# Altium project HAGateWay202205V10.PrjPcb (part 2 of 2)

## Sheet 11. MT7688AN Ethernet.SchDoc
size A4; DocumentNumber: 11; SheetNumber: 11; SheetTotal: 12
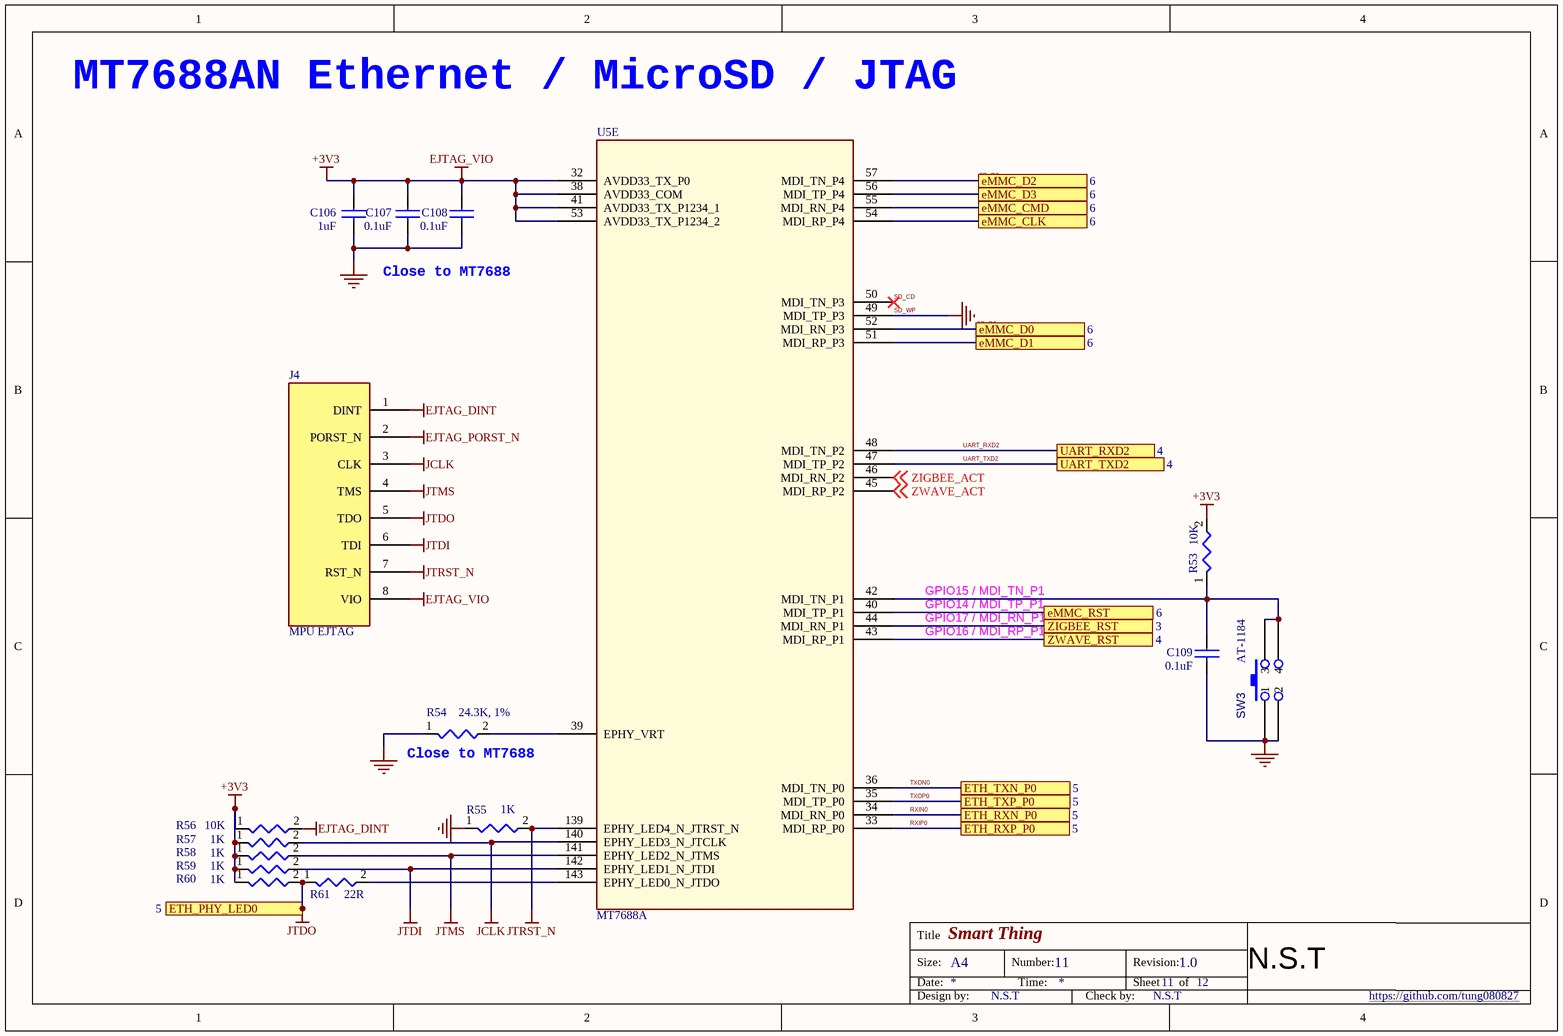
[diagram p11: 11. MT7688AN Ethernet.SchDoc]

### Parts
C106  1uF  [CAPC1005X60X30NL05T10]
C107  0.1uF  [CAPC1005X60X30NL05T10]
C108  0.1uF  [CAPC1005X60X30NL05T10]
C109  0.1uF  [CAPC1005X60X30NL05T10]
J4  MPU EJTAG  [MPU EJTAG DEBUG]
R53  10K  [RESC1005X35X25NL10T10]
R54  24.3K, 1%  [RESC1005X35X25NL10T10]
R55  1K  [RESC1005X35X25NL10T10]
R56  10K  [RESC1005X35X25NL10T10]
R57  1K  [RESC1005X35X25NL10T10]
R58  1K  [RESC1005X35X25NL10T10]
R59  1K  [RESC1005X35X25NL10T10]
R60  1K  [RESC1005X35X25NL10T10]
R61  22R  [RESC1005X35X25NL10T10]
SW3  AT-1184  [AT-1184 SW]
U5  MT7688A  [MT7628AN$2F$DRQFN156$2F$SMD$2F$P0.5$2F$12X12]  (part E of 6)

### Ports
eMMC_CLK (see 6), eMMC_CMD (see 6), eMMC_D0 (see 6), eMMC_D1 (see 6), eMMC_D2 (see 6), eMMC_D3 (see 6), eMMC_RST (see 6), ETH_PHY_LED0 (see 5), ETH_RXN_P0 (see 5), ETH_RXP_P0 (see 5), ETH_TXN_P0 (see 5), ETH_TXP_P0 (see 5), UART_RXD2 (see 4), UART_TXD2 (see 4), ZIGBEE_RST (see 3), ZWAVE_RST (see 4)

### Nets
+3V3: C106.1 C107.1 C108.1 J4.8(VIO) R53.2 R56.1 R57.1 R58.1 R59.1 R60.1 U5.32(AVDD33_TX_P0) U5.38(AVDD33_COM) U5.41(AVDD33_TX_P1234_1) U5.53(AVDD33_TX_P1234_2)  [also labelled EJTAG_VIO]
EJTAG_DINT: J4.1(DINT) R56.2
EJTAG_PORST_N: J4.2(PORST_N)
GND: C106.2 C107.2 C108.2 C109.2 R54.1 R55.1 SW3.1 SW3.2 U5.49(MDI_TP_P3)  [also labelled SD_WP]
JCLK: J4.3(CLK) R57.2 U5.140(EPHY_LED3_N_JTCLK)
JTDI: J4.6(TDI) R59.2 U5.142(EPHY_LED1_N_JTDI)
JTDO: J4.5(TDO) R60.2 R61.1 ; port ETH_PHY_LED0
JTMS: J4.4(TMS) R58.2 U5.141(EPHY_LED2_N_JTMS)
JTRST_N: J4.7(RST_N) R55.2 U5.139(EPHY_LED4_N_JTRST_N)
GPIO14 / MDI_TP_P1: U5.40(MDI_TP_P1) ; port eMMC_RST
GPIO15 / MDI_TN_P1: C109.1 R53.1 SW3.3 SW3.4 U5.42(MDI_TN_P1)
GPIO16 / MDI_RP_P1: U5.43(MDI_RP_P1) ; port ZWAVE_RST
GPIO17 / MDI_RN_P1: U5.44(MDI_RN_P1) ; port ZIGBEE_RST
RXIN0: U5.34(MDI_RN_P0) ; port ETH_RXN_P0  [project net ETH_RX_N]
RXIP0: U5.33(MDI_RP_P0) ; port ETH_RXP_P0  [project net ETH_RX_P]
SD_CD: U5.50(MDI_TN_P3)
SD_CLK: U5.54(MDI_RP_P4) ; port eMMC_CLK  [project net eMMC_CLKL]
SD_CMD: U5.55(MDI_RN_P4) ; port eMMC_CMD
SD_D0: U5.52(MDI_RN_P3) ; port eMMC_D0
SD_D1: U5.51(MDI_RP_P3) ; port eMMC_D1
SD_D2: U5.57(MDI_TN_P4) ; port eMMC_D2
SD_D3: U5.56(MDI_TP_P4) ; port eMMC_D3
TXON0: U5.36(MDI_TN_P0) ; port ETH_TXN_P0  [project net ETH_TX_N]
TXOP0: U5.35(MDI_TP_P0) ; port ETH_TXP_P0  [project net ETH_TX_P]
UART_RXD2: U5.48(MDI_TN_P2) ; port UART_RXD2
UART_TXD2: U5.47(MDI_TP_P2) ; port UART_TXD2
ZIGBEE_ACT: U5.46(MDI_RN_P2) ; off-sheet ZIGBEE_ACT
ZWAVE_ACT: U5.45(MDI_RP_P2) ; off-sheet ZWAVE_ACT
NetR54_2: R54.2 U5.39(EPHY_VRT)
NetR61_2: R61.2 U5.143(EPHY_LED0_N_JTDO)

### Notes on the sheet
- MT7688AN Ethernet / MicroSD / JTAG
- Close to MT7688
- (near R54) Close to MT7688
- Title
- Size:
- Date:
- A4
- Number:
- Time:
- Revision:
- Sheet
- of
- N.S.T
- Design by:
- Check by:
- https://github.com/tung080827

### Library data of the parts
C106-C109 = CAP NP
R53-R61 = RES/0402_3
SW3 = SW: TACT Switch, H=1.5mm; Manufacturer: Panasonic - ECG; Manufacturer P/N: EVQ-Q2B01W; Distributor P/N: P12930SCT-ND; Distributor: Digikey
U5 = MT7620N-n_26

## Sheet 12. MT7688AN Power.SchDoc
size A4; DocumentNumber: 12; SheetNumber: 12; SheetTotal: 12
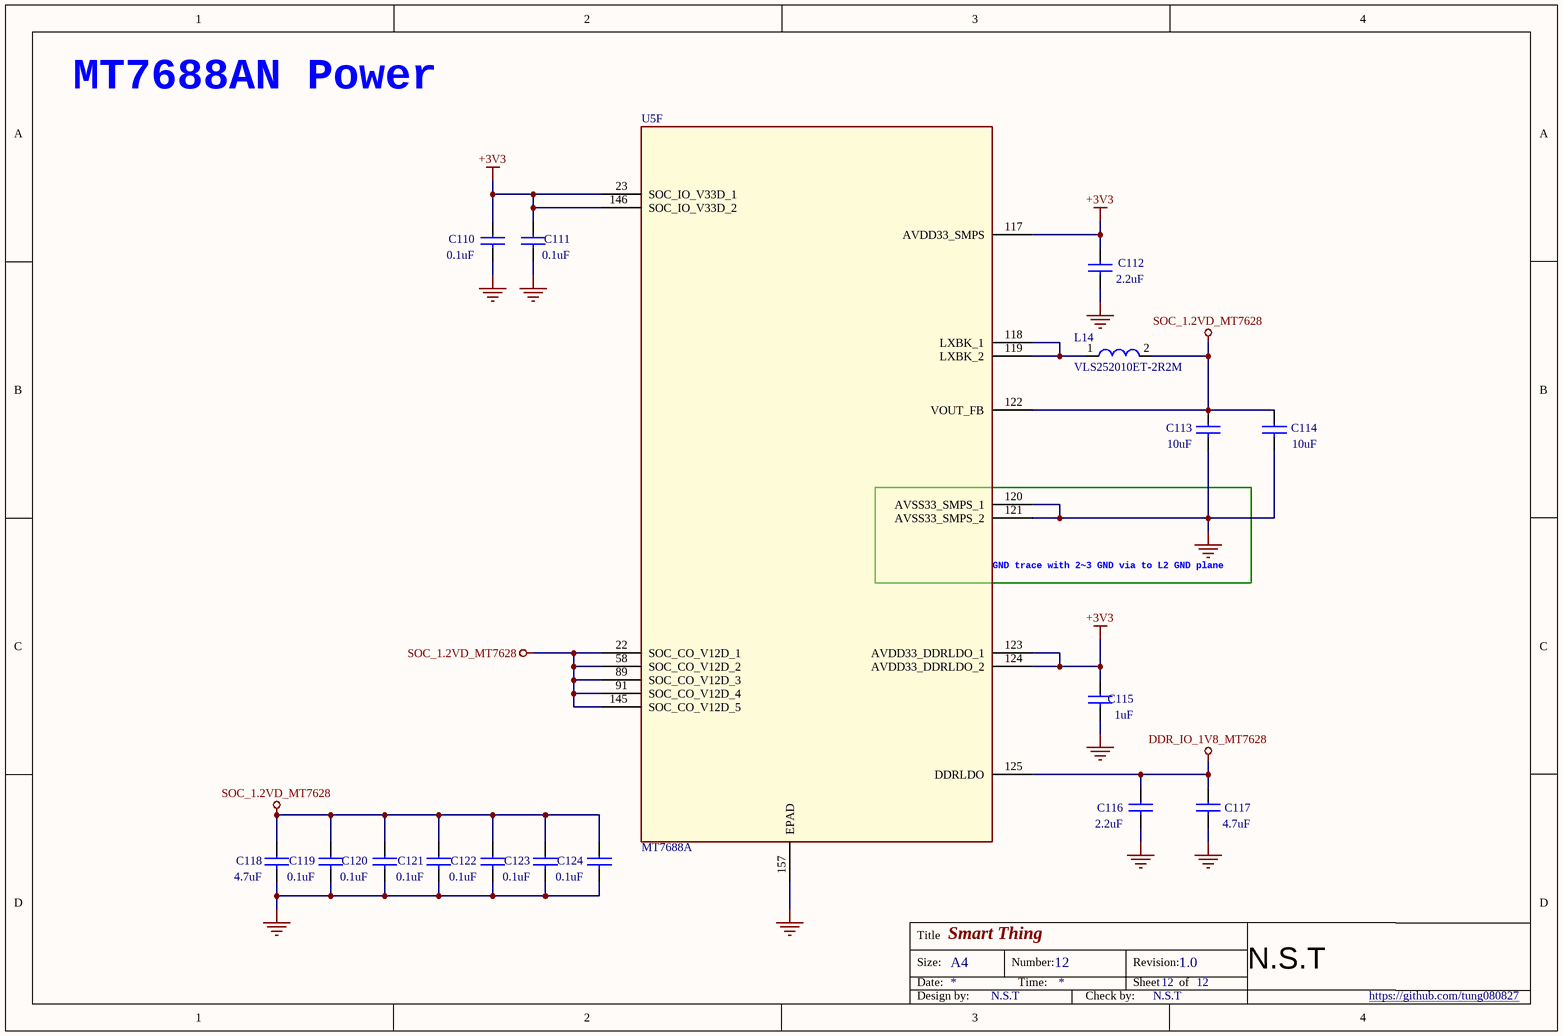
[diagram p12: 12. MT7688AN Power.SchDoc]

### Parts
C110  0.1uF  [CAPC1005X55X25NL05T10]
C111  0.1uF  [CAPC1005X55X25NL05T10]
C112  2.2uF  [CAPC1608X90X35NL10T15]
C113  10uF  [CAPC1608X90X35NL10T15]
C114  10uF  [CAPC1608X90X35NL10T15]
C115  1uF  [CAPC1608X90X35NL10T15]
C116  2.2uF  [CAPC1608X90X35NL10T15]
C117  4.7uF  [CAPC1005X55X25NL05T10]
C118  4.7uF  [CAPC1005X55X25NL05T10]
C119  0.1uF  [CAPC1005X55X25NL05T10]
C120  0.1uF  [CAPC1005X55X25NL05T10]
C121  0.1uF  [CAPC1005X55X25NL05T10]
C122  0.1uF  [CAPC1005X55X25NL05T10]
C123  0.1uF  [CAPC1005X55X25NL05T10]
C124  0.1uF  [CAPC1005X55X25NL05T10]
L14  VLS252010ET-2R2M  [VLS252010/TDK INDUCTOR]
U5  MT7688A  [MT7628AN$2F$DRQFN156$2F$SMD$2F$P0.5$2F$12X12]  (part F of 6)

### Nets
+3V3: C110.1 C111.1 C112.1 C115.1 U5.23(SOC_IO_V33D_1) U5.117(AVDD33_SMPS) U5.123(AVDD33_DDRLDO_1) U5.124(AVDD33_DDRLDO_2) U5.146(SOC_IO_V33D_2)
DDR_IO_1V8_MT7628: C116.1 C117.1 U5.125(DDRLDO)
GND: C110.2 C111.2 C112.2 C113.2 C114.2 C115.2 C116.2 C117.2 C118.2 C119.2 C120.2 C121.2 C122.2 C123.2 C124.2 U5.120(AVSS33_SMPS_1) U5.121(AVSS33_SMPS_2) U5.157(EPAD)
SOC_1.2VD_MT7628: C113.1 C114.1 C118.1 C119.1 C120.1 C121.1 C122.1 C123.1 C124.1 L14.2 U5.22(SOC_CO_V12D_1) U5.58(SOC_CO_V12D_2) U5.89(SOC_CO_V12D_3) U5.91(SOC_CO_V12D_4) U5.122(VOUT_FB) U5.145(SOC_CO_V12D_5)
NetL14_1: L14.1 U5.118(LXBK_1) U5.119(LXBK_2)

### Notes on the sheet
- MT7688AN Power
- (near U5) GND trace with 2~3 GND via to L2 GND plane
- Title
- Size:
- Date:
- A4
- Number:
- Time:
- Revision:
- Sheet
- of
- N.S.T
- Design by:
- Check by:
- https://github.com/tung080827

### Library data of the parts
C110-C124 = CAP NP
L14 = L/0402: IND 0805 METAL 2.2uH 0.19R 1.2A T=1.0mm
U5 = MT7620N-n_26

## Nets that join several sheets
+3V3: 02. POWER (5 pins), 03. ZIGBEE (FB1.1 FB2.1 TP1.1), 04. Z-WAVE (FB3.2 R9.2), 06. ETHERNET (J1.9 J1.12 R12.2), 05. eMMC (22 pins), 07. MT7688AN RF Front End (C44.1 C45.1 C46.1 R20.1), 09. MT7688AN Peripheral (12 pins), 10. MT7688AN USB-PCIe (5 pins), 11. MT7688AN Ethernet (14 pins), 12. MT7688AN Power (9 pins)
+5V_USB: 02. POWER (5 pins), 09. MT7688AN Peripheral (6 pins), 10. MT7688AN USB-PCIe (C104.1 C105.1 J3.1)
DDR_IO_1V8_MT7628: 08. MT7688AN DDR2 (38 pins), 12. MT7688AN Power (C116.1 C117.1 U5.125)
EARTH: 06. ETHERNET (J1.S1 J1.S2 R19.2), 10. MT7688AN USB-PCIe (J3.Shell)
EJTAG_PORST_N: 09. MT7688AN Peripheral (R38.2 R39.2 R42.1 RC1.1), 11. MT7688AN Ethernet (J4.2)
GND: 02. POWER (8 pins), 03. ZIGBEE (46 pins), 04. Z-WAVE (14 pins), 06. ETHERNET (5 pins), 05. eMMC (17 pins), 07. MT7688AN RF Front End (42 pins), 08. MT7688AN DDR2 (38 pins), 09. MT7688AN Peripheral (17 pins), 10. MT7688AN USB-PCIe (9 pins), 11. MT7688AN Ethernet (9 pins), 12. MT7688AN Power (18 pins)
JTDO: 06. ETHERNET (R13.1 R14.1), 11. MT7688AN Ethernet (J4.5 R60.2 R61.1)
SOC_1.2VD_MT7628: 10. MT7688AN USB-PCIe (C100.1 U5.131), 12. MT7688AN Power (16 pins)
eMMC_CLKL: 05. eMMC (R70.1), 11. MT7688AN Ethernet (U5.54)
ETH_RX_N: 06. ETHERNET (J1.6 R18.2), 11. MT7688AN Ethernet (U5.34)
ETH_RX_P: 06. ETHERNET (J1.4 R17.2), 11. MT7688AN Ethernet (U5.33)
ETH_TX_N: 06. ETHERNET (J1.3 R16.2), 11. MT7688AN Ethernet (U5.36)
ETH_TX_P: 06. ETHERNET (J1.1 R15.2), 11. MT7688AN Ethernet (U5.35)
GPIO0 / I2S_SDI: 03. ZIGBEE (U1.7), 09. MT7688AN Peripheral (U5.16)
GPIO3 / I2S_CLK: 03. ZIGBEE (U1.6), 09. MT7688AN Peripheral (U5.19)
GPIO14 / MDI_TP_P1: 05. eMMC (R69.1), 11. MT7688AN Ethernet (U5.40)
GPIO16 / MDI_RP_P1: 04. Z-WAVE (C34.2 R9.1 U3.2), 11. MT7688AN Ethernet (U5.43)
GPIO17 / MDI_RN_P1: 03. ZIGBEE (R2.1 TP6.1), 11. MT7688AN Ethernet (U5.44)
NetR33_1: 03. ZIGBEE (U1.8), 09. MT7688AN Peripheral (R33.1)
NetR35_1: 03. ZIGBEE (U1.9), 09. MT7688AN Peripheral (R35.1)
PERST_N: 09. MT7688AN Peripheral (R29.2), 10. MT7688AN USB-PCIe (U5.135)
SD_CMD: 05. eMMC (R67.1 U9.M5), 11. MT7688AN Ethernet (U5.55)
SD_D0: 05. eMMC (R62.1 U9.A3), 11. MT7688AN Ethernet (U5.52)
SD_D1: 05. eMMC (R63.1 U9.A4), 11. MT7688AN Ethernet (U5.51)
SD_D2: 05. eMMC (R64.1 U9.A5), 11. MT7688AN Ethernet (U5.57)
SD_D3: 05. eMMC (R65.1 U9.B2), 11. MT7688AN Ethernet (U5.56)
UART_RXD1: 03. ZIGBEE (U1.16), 09. MT7688AN Peripheral (U5.148)
UART_RXD2: 04. Z-WAVE (R11.2), 11. MT7688AN Ethernet (U5.48)
UART_TXD1: 03. ZIGBEE (U1.17), 09. MT7688AN Peripheral (R31.2 R34.2 U5.147)
UART_TXD2: 04. Z-WAVE (R10.2), 11. MT7688AN Ethernet (U5.47)
ZIGBEE_ACT: 09. MT7688AN Peripheral (R47.1), 11. MT7688AN Ethernet (U5.46)
ZWAVE_ACT: 09. MT7688AN Peripheral (R44.1), 11. MT7688AN Ethernet (U5.45)